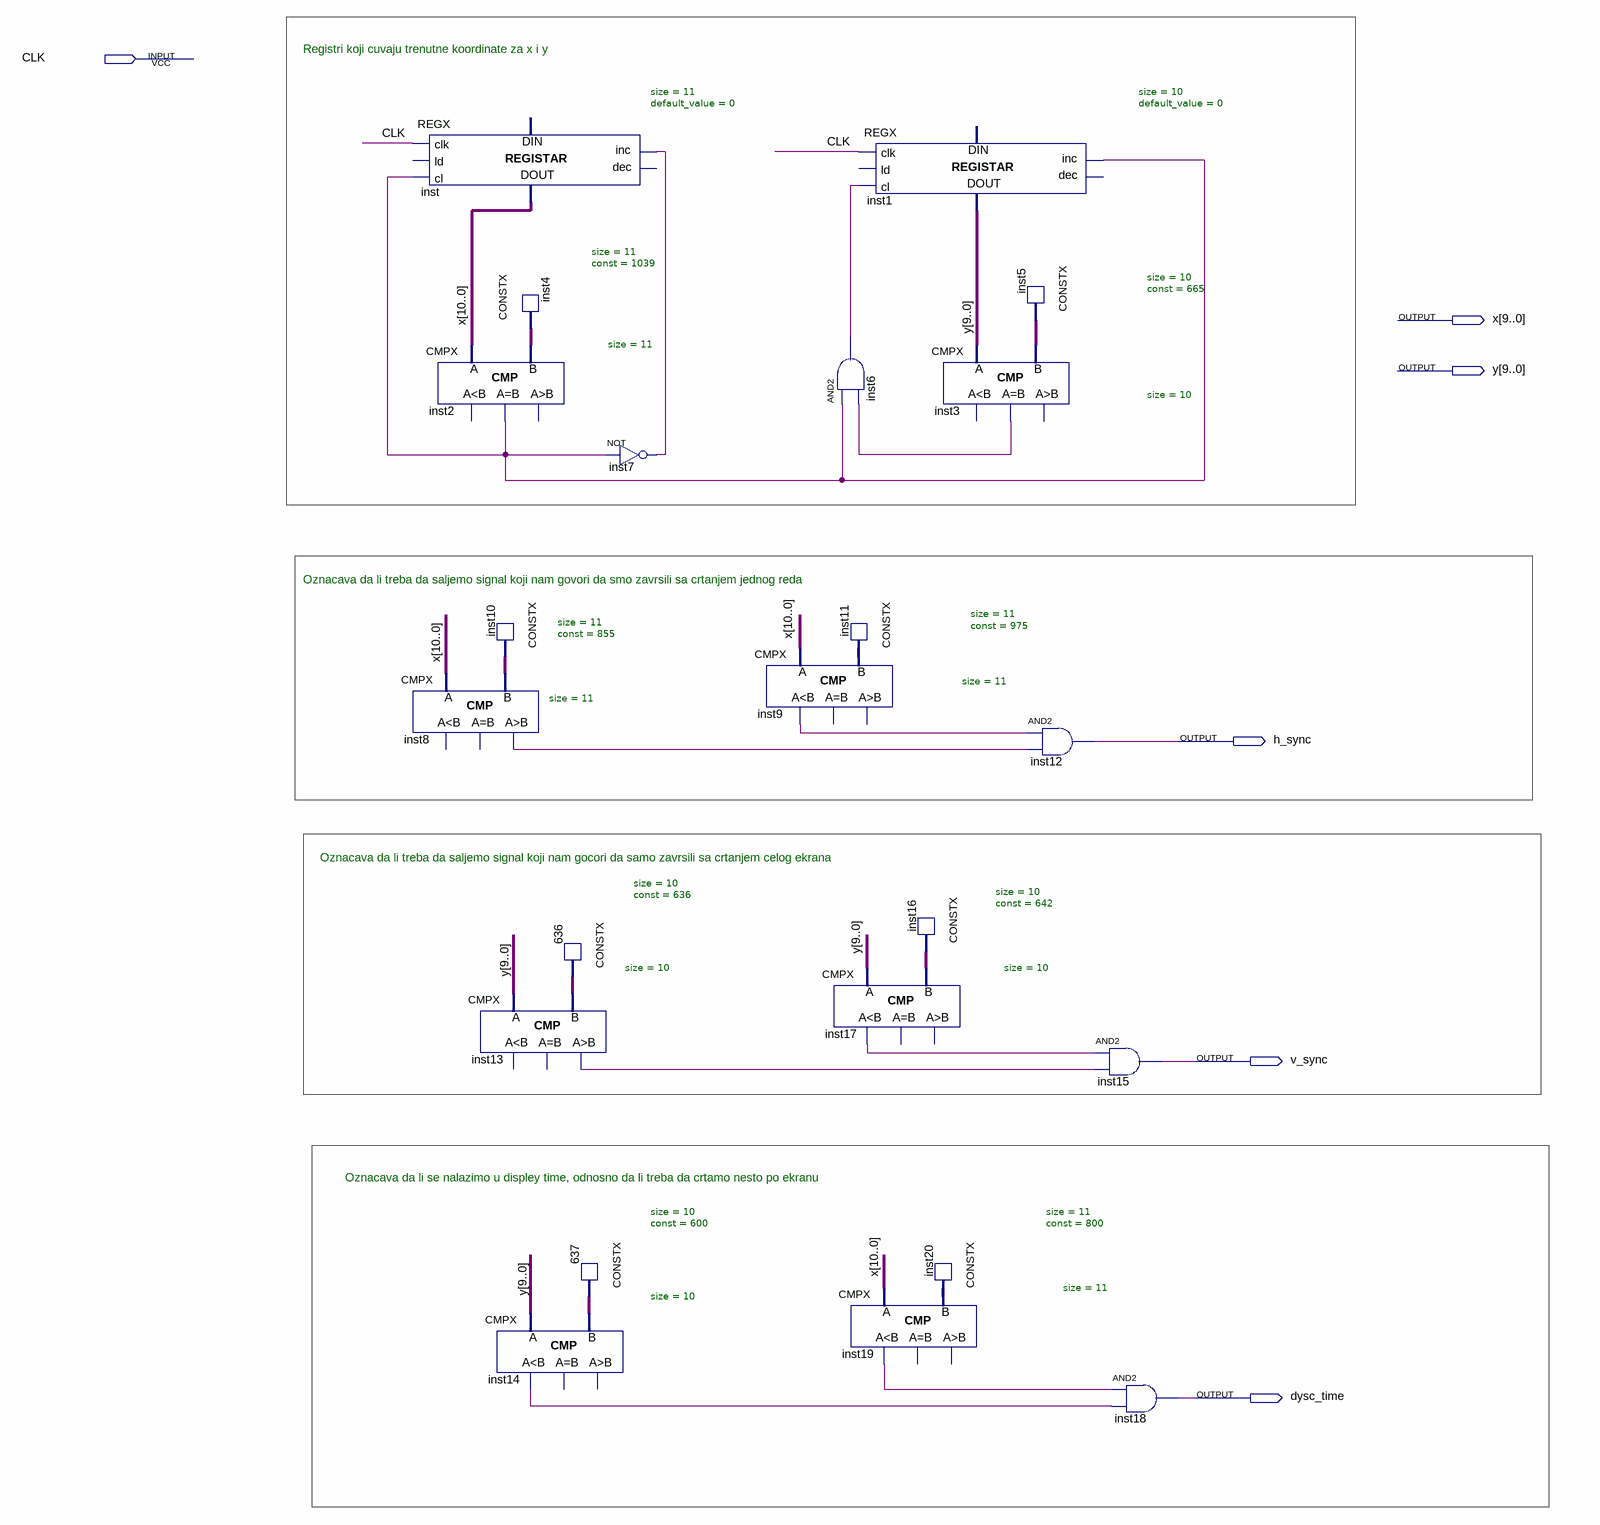
[diagram p0: schematic sheet]
// Quartus schematic VGAControler.bdf as structural Verilog: 23 symbols, 6 pins
module VGAControler (
  input  CLK,
  output [10:0] x,
  output [9:0] y,
  output h_sync,
  output v_sync,
  output dysc_time
);

  wire inst2_eq, inst3_eq, inst6_out, inst7_out, inst8_gr, inst9_ls, inst13_gr, inst14_ls, inst17_ls,
       inst19_ls;
  wire [9:0] inst5_data, inst16_data, n636_data, n637_data;
  wire [10:0] inst4_data, inst10_data, inst11_data, inst20_data;

  REGX #(.size(11), .default_value(0)) inst (
    .clk(CLK), .cl(inst2_eq), .inc(inst7_out), .data_out(x));  // open: ld, dec, data_in
  CMPX #(.size(11)) inst2 (.A(x), .B(inst4_data), .eq(inst2_eq));  // open: ls, gr
  CMPX #(.size(11)) inst8 (.A(x), .B(inst10_data), .gr(inst8_gr));  // open: ls, eq
  CONSTX #(.size(11), .\const (1039)) inst4 (.data(inst4_data));
  CONSTX #(.size(11), .\const (855)) inst10 (.data(inst10_data));
  CMPX #(.size(10)) inst13 (.A(y), .B(n636_data), .gr(inst13_gr));  // open: ls, eq
  CMPX #(.size(10)) inst14 (.A(y), .B(n637_data), .ls(inst14_ls));  // open: eq, gr
  CONSTX #(.size(10), .\const (636)) u_636 (.data(n636_data));
  CONSTX #(.size(10), .\const (600)) u_637 (.data(n637_data));
  not inst7 (inst7_out, inst2_eq);
  CMPX #(.size(11)) inst9 (.A(x), .B(inst11_data), .ls(inst9_ls));  // open: eq, gr
  REGX #(.size(10), .default_value(0)) inst1 (
    .clk(CLK), .cl(inst6_out), .inc(inst2_eq), .data_out(y));  // open: ld, dec, data_in
  and inst6 (inst6_out, inst2_eq, inst3_eq);
  CONSTX #(.size(11), .\const (975)) inst11 (.data(inst11_data));
  CMPX #(.size(10)) inst17 (.A(y), .B(inst16_data), .ls(inst17_ls));  // open: eq, gr
  CMPX #(.size(11)) inst19 (.A(x), .B(inst20_data), .ls(inst19_ls));  // open: eq, gr
  CMPX #(.size(10)) inst3 (.A(y), .B(inst5_data), .eq(inst3_eq));  // open: ls, gr
  CONSTX #(.size(10), .\const (642)) inst16 (.data(inst16_data));
  CONSTX #(.size(11), .\const (800)) inst20 (.data(inst20_data));
  CONSTX #(.size(10), .\const (665)) inst5 (.data(inst5_data));
  and inst12 (h_sync, inst9_ls, inst8_gr);
  and inst15 (v_sync, inst17_ls, inst13_gr);
  and inst18 (dysc_time, inst19_ls, inst14_ls);

  // Notes on the sheet:
  //   Registri koji cuvaju trenutne koordinate za x i y                                                                                                                                                                             
  //   Oznacava da li treba da saljemo signal koji nam govori da smo zavrsili sa crtanjem jednog reda                                                                                   
  //   Oznacava da li treba da saljemo signal koji nam gocori da samo zavrsili sa crtanjem celog ekrana                                                                                       
  //   Oznacava da li se nalazimo u displey time, odnosno da li treba da crtamo nesto po ekranu                                                                                    
endmodule
